# EAGLE design LB_BIT_o1_LED (EAGLE 6.0)
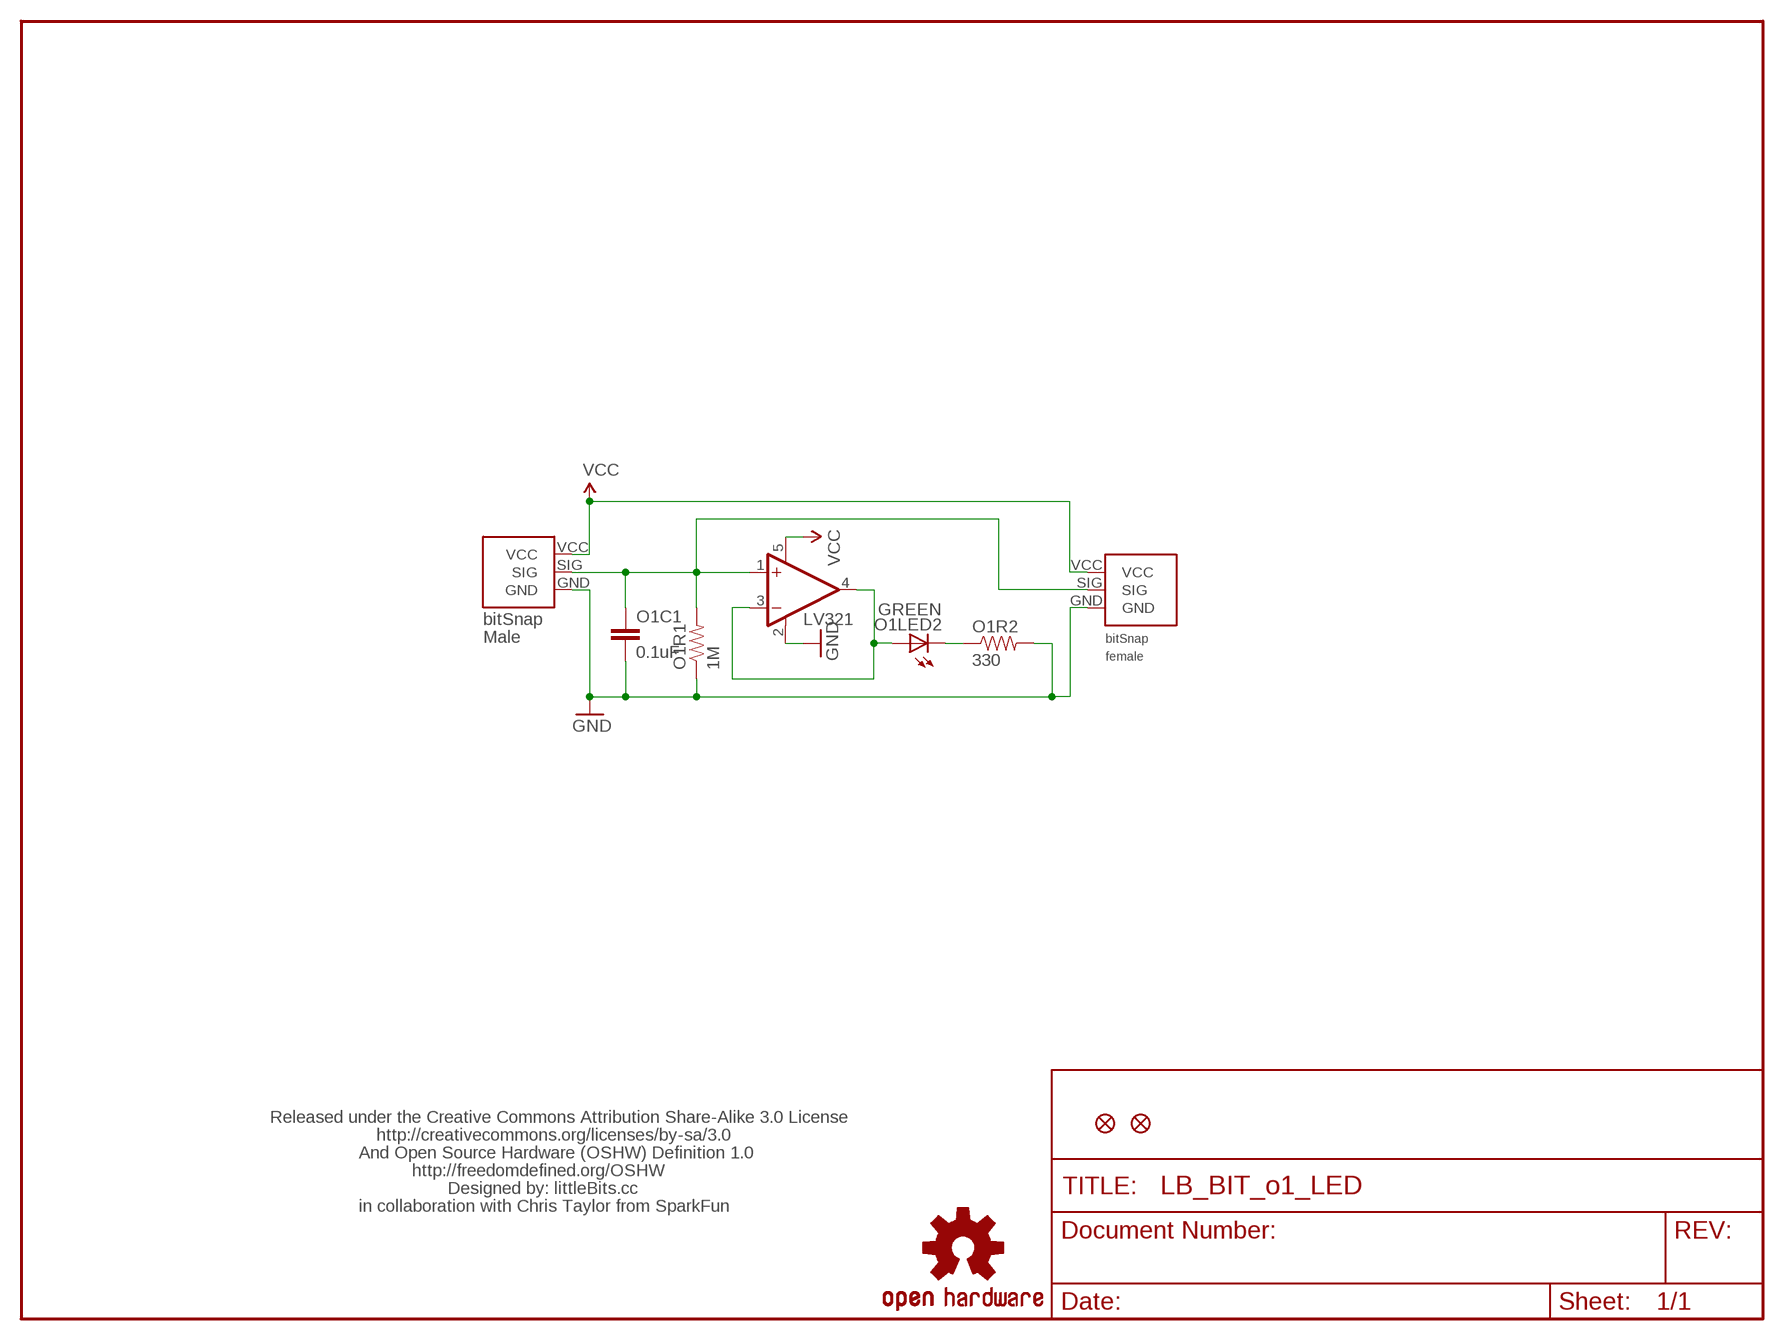
[diagram p0: schematic, sheet 1]

## Parts
JP1  FIDUCIAL1X2.5  [FIDUCIAL-1X2.5]
JP2  FIDUCIAL1X2.5  [FIDUCIAL-1X2.5]
O1BSF  BITSNAP_FEMALE  [BITSNAP_FEMALE]
O1BSM  BITSNAP_MALE  [BITSNAP_MALE]
O1C1  0.1uF  CAP0603-CAP  [0603-CAP]
O1LED2  GREEN  LED1206  [LED-1206]
O1R1  1M  RESISTOR0603-RES  [0603-RES]
O1R2  330  RESISTOR0603-RES  [0603-RES]
O1U1  LV321  [SC70]
U$1  LB_CREDITS  [OSHWCREDIT]
U$3  OSHW-LOGOL  [OSHW-LOGO-L]

## Nets
GND: O1BSF.GND O1BSM.GND O1C1.2 O1R1.1 O1R2.2 O1U1.2(V-)
LEDGND: O1LED2.C O1R2.1
N$1: O1LED2.A O1U1.3(-IN) O1U1.4(OUT)
SIG: O1BSF.SIG O1BSM.SIG O1C1.1 O1R1.2 O1U1.1(+IN)
VCC: O1BSF.VCC O1BSM.VCC O1U1.5(V+)

## Library data of the parts
JP1 JP2 = abes:FIDUCIAL: Fiducial Alignment Points Various fiducial points for machine vision alignment.
O1BSF = bitSnap:BITSNAP_FEMALE
O1BSM = bitSnap:BITSNAP_MALE
O1C1 = SparkFun:CAP: Capacitor Standard 0603 ceramic capacitor, and 0.1" leaded capacitor.
O1LED2 = SparkFun:LED: LEDs Standard schematic elements and footprints for 5mm, 3mm, 1206, and 0603 sized LEDs. 5mm - Spark Fun Electronics SKU : COM-00529 (and others)
O1R1 O1R2 = SparkFun:RESISTOR: Resistor Basic schematic elements and footprints for 0603, 1206, and PTH 1/10th watt (small) resistors.
O1U1 = LITTLEBITS:LV321
U$1 = LITTLEBITS:LB_CREDITS
U$3 = SparkFun:OSHW-LOGO: Open Source Hardware Logo This logo indicates the piece of hardware it is found on incorporates a OSHW license and/or adheres to the definition of open source hardware found here: http://freedomdefined.org/OSHW

## Board
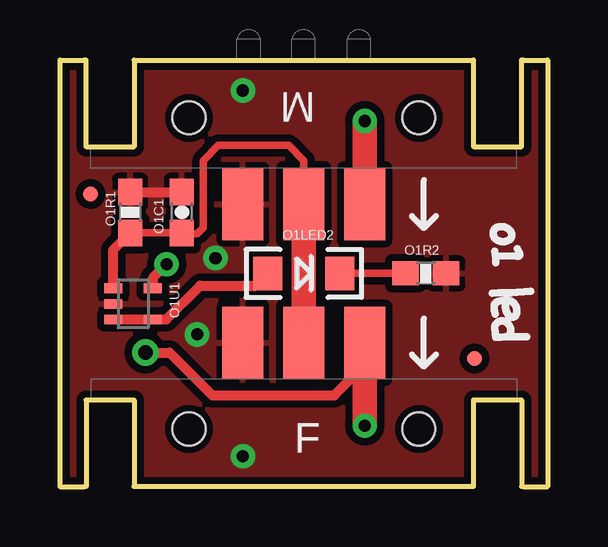
[diagram p1: board, top side]
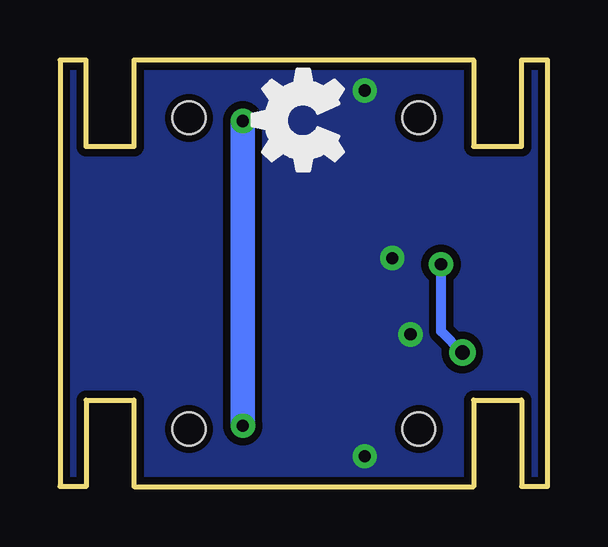
[diagram p2: board, bottom side, seen from below]

Size 20.32 x 17.78 mm. Coordinates in mm from the lower left corner, seen from the top.
Outline: 1.02,17.78 0,17.78 0,0 1.02,0
Outline: 19.3,17.78 20.32,17.78 20.32,0 19.3,0
Copper layers (1*16): Top 0.035mm / dielectric 1.5mm / Bottom 0.035mm
Design rules: minimum track width 8mil, minimum drill 20mil, track to track 8mil, track to pad 8mil, pad to pad 8mil, via to via 8mil, smd to smd 8mil, copper to edge 8mil, drill to drill 8mil, minimum pad ring 12mil, minimum via ring 10mil, stop-mask expansion 4mil, vias tented up to drill 20mil, thermal gap 10mil

### Footprints (pad centres in the part's own frame; a part is rotated, then mirrored left to right if it is on the bottom)
FIDUCIAL-1X2.5 = smd 0.635 x 0.635: 1 0,0
BITSNAP_FEMALE = smd 1.7 x 3: GND 6.35,6; SIG 8.89,6; VCC 11.43,6 | hole 1.37: 13.68,2.41; 4.1,2.41
BITSNAP_MALE = smd 1.7 x 3: GND 11.43,6; SIG 8.89,6; VCC 6.35,6 | hole 1.37: 13.68,2.41; 4.1,2.41
0603-CAP = smd 1.1 x 1: 1 -0.85,0; 2 0.85,0
LED-1206 = smd 1.2 x 1.4: A -1.5,0; C 1.5,0
0603-RES = smd 1.1 x 1: 1 -0.85,0; 2 0.85,0
SC70 = smd 0.4 x 0.75: 1 -0.65,-0.825; 2 0,-0.825; 3 0.65,-0.825; 4 0.65,0.825; 5 -0.65,0.825

### Placement (x,y rotation side)
JP1  17.27,5.33 0 top
JP2  1.27,12.19 0 top
O1BSF  1.27,0 0 top
O1BSM  19.05,17.78 180 top
O1C1  5.08,11.43 90 top
O1LED2  10.16,8.89 0 top
O1R1  2.92,11.43 270 top
O1R2  15.24,8.89 0 top
O1U1  3.05,7.62 270 top
U$1  8.89,-17.78 0 top  (outside the outline)
U$2  [OSHW_FILLX150_NOTEXT]  8.51,12.32 0 top
U$3  -12.7,-10.16 0 top  (outside the outline)

### Tracks (layer width: path | path; a pad name or v marks a point on that pad's centre or on a via)
GND  (via drill 0.51)
  Top 0.406: O1R1.1 O1C1.2
  other vias: 7.62,16.51 6.48,9.53 5.71,6.35 7.62,1.27
  pour Top (isolate 0.305): 0,17.78 20.32,17.78 20.32,0 0,0
  pour Bottom (isolate 0.305): 0,17.78 0,0 20.32,0 20.32,17.78
LEDGND
  Top 0.305: O1LED2.C O1R2.1
N$1
  Top 0.406: O1U1.3 O1U1.4 4.43,6.97 5.84,8.38 8.15,8.38 O1LED2.A
SIG
  Top 0.305: 2.91,10.64 O1R1.2 O1C1.1 5.09,10.54 5.71,10.54 5.97,10.79 5.97,13.59 6.6,14.22 9.53,14.22 10.16,13.59 O1BSM.SIG
  Top 0.406: O1U1.1 2.22,9.88 O1R1.2
  Top 1.016: O1BSM.SIG O1BSF.SIG
VCC  (via drill 0.51, 0.6)
  Top 0.305: 12.7,5.08 O1BSF.VCC
  Top 0.406: 12.7,5.08 11.43,3.81 6.35,3.81 4.57,5.59 v3.56,5.59 | O1U1.5 3.87,8.7 v4.45,9.27
  Top 1.016: v12.7,15.24 O1BSM.VCC | 12.7,5.08 v12.7,2.54
  Bottom 0.406: v4.45,9.27 4.45,6.48 v3.56,5.59
  Bottom 1.016: v12.7,2.54 v12.7,15.24